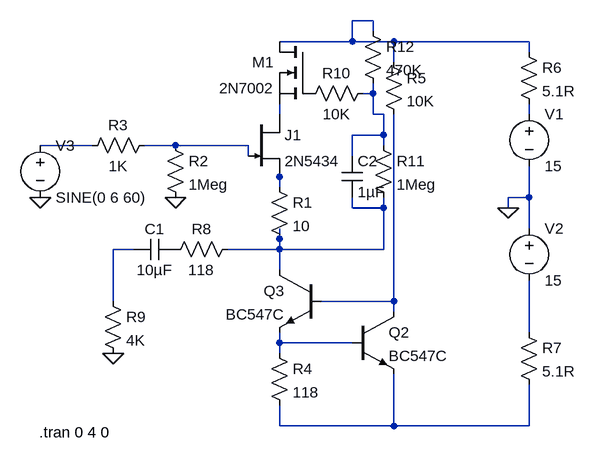
[diagram p0: schematic 2015jFetBuf.asc]
2015jFetBuf.asc, the LTspice schematic file:
Version 4
SHEET 1 880 680
WIRE 320 -64 288 -64
WIRE 320 -48 320 -64
WIRE 288 -32 288 -64
WIRE 288 -32 176 -32
WIRE 352 -32 288 -32
WIRE 560 -32 352 -32
WIRE 560 -16 560 -32
WIRE 352 0 352 -32
WIRE 320 48 320 32
WIRE 320 48 304 48
WIRE 176 80 176 64
WIRE 320 80 320 48
WIRE 336 80 320 80
WIRE 560 80 560 64
WIRE 336 112 336 80
WIRE 336 112 288 112
WIRE -112 128 -192 128
WIRE 16 128 -32 128
WIRE 128 128 16 128
WIRE 336 128 336 112
WIRE 128 144 128 128
WIRE 288 144 288 112
WIRE 176 176 176 160
WIRE 176 192 176 176
WIRE 560 208 560 160
WIRE 560 208 528 208
WIRE 288 224 288 208
WIRE 336 224 336 208
WIRE 336 224 288 224
WIRE 528 224 528 208
WIRE 560 256 560 208
WIRE 176 272 176 256
WIRE -48 288 -80 288
WIRE 176 288 176 272
WIRE 176 288 96 288
WIRE 336 288 336 224
WIRE 336 288 176 288
WIRE 176 320 176 288
WIRE -80 368 -80 288
WIRE 352 368 352 80
WIRE 352 368 240 368
WIRE 352 384 352 368
WIRE 560 416 560 336
WIRE 176 432 176 416
WIRE 288 432 176 432
WIRE 176 448 176 432
WIRE 176 560 176 528
WIRE 352 560 352 480
WIRE 352 560 176 560
WIRE 560 560 560 496
WIRE 560 560 352 560
FLAG 16 208 0
FLAG 528 224 0
FLAG -80 448 0
FLAG -192 208 0
SYMBOL njf 128 80 R0
SYMATTR InstName J1
SYMATTR Value 2N5434
SYMBOL res 160 176 R0
SYMATTR InstName R1
SYMATTR Value 10
SYMBOL res 0 112 R0
SYMATTR InstName R2
SYMATTR Value 1Meg
SYMBOL res -16 112 R90
WINDOW 0 0 56 VBottom 2
WINDOW 3 32 56 VTop 2
SYMATTR InstName R3
SYMATTR Value 1K
SYMBOL npn 288 384 R0
SYMATTR InstName Q2
SYMATTR Value BC547C
SYMBOL npn 240 320 M0
SYMATTR InstName Q3
SYMATTR Value BC547C
SYMBOL res 160 432 R0
SYMATTR InstName R4
SYMATTR Value 118
SYMBOL res 336 -16 R0
SYMATTR InstName R5
SYMATTR Value 10K
SYMBOL voltage 560 64 R0
WINDOW 123 0 0 Left 2
WINDOW 39 0 0 Left 2
SYMATTR InstName V1
SYMATTR Value 15
SYMBOL voltage 560 240 R0
WINDOW 123 0 0 Left 2
WINDOW 39 0 0 Left 2
SYMATTR InstName V2
SYMATTR Value 15
SYMBOL res 544 -32 R0
SYMATTR InstName R6
SYMATTR Value 5.1R
SYMBOL res 544 400 R0
SYMATTR InstName R7
SYMATTR Value 5.1R
SYMBOL res 112 272 R90
WINDOW 0 0 56 VBottom 2
WINDOW 3 32 56 VTop 2
SYMATTR InstName R8
SYMATTR Value 118
SYMBOL cap 16 272 R90
WINDOW 0 0 32 VBottom 2
WINDOW 3 32 32 VTop 2
SYMATTR InstName C1
SYMATTR Value 10µF
SYMBOL res -96 352 R0
SYMATTR InstName R9
SYMATTR Value 4K
SYMBOL voltage -192 112 R0
WINDOW 123 0 0 Left 2
WINDOW 39 0 0 Left 2
SYMATTR InstName V3
SYMATTR Value SINE(0 6 60)
SYMBOL nmos 224 -32 M0
SYMATTR InstName M1
SYMATTR Value 2N7002
SYMBOL res 320 32 R90
WINDOW 0 0 56 VBottom 2
WINDOW 3 32 56 VTop 2
SYMATTR InstName R10
SYMATTR Value 10K
SYMBOL cap 272 144 R0
SYMATTR InstName C2
SYMATTR Value 1µF
SYMBOL res 320 112 R0
SYMATTR InstName R11
SYMATTR Value 1Meg
SYMBOL res 304 -64 R0
SYMATTR InstName R12
SYMATTR Value 470K
TEXT -194 570 Left 2 !.tran 0 4 0

The netlist it stands for:
* 2015jFetBuf.asc
J1 N003 N006 N007 2N5434
R1 N007 N008 10
R2 N006 0 1Meg
R3 N006 N005 1K
Q2 N010 N012 N013 0 BC547C
Q3 N008 N010 N012 0 BC547C
R4 N012 N013 118
R5 N001 N010 10K
V1 N004 0 15
V2 0 N011 15
R6 N001 N004 5.1R
R7 N011 N013 5.1R
R8 N008 P001 118
C1 P001 N009 10µF
R9 N009 0 4K
V3 N005 0 SINE(0 6 60)
M1 N001 P002 N003 N003 2N7002
R10 N002 P002 10K
C2 N002 N008 1µF
R11 N002 N008 1Meg
R12 N001 N002 470K
.model NPN NPN
.model PNP PNP
.lib standard.bjt
.model NJF NJF
.model PJF PJF
.lib standard.jft
.model NMOS NMOS
.model PMOS PMOS
.lib standard.mos
.tran 0 4 0
.backanno
.end